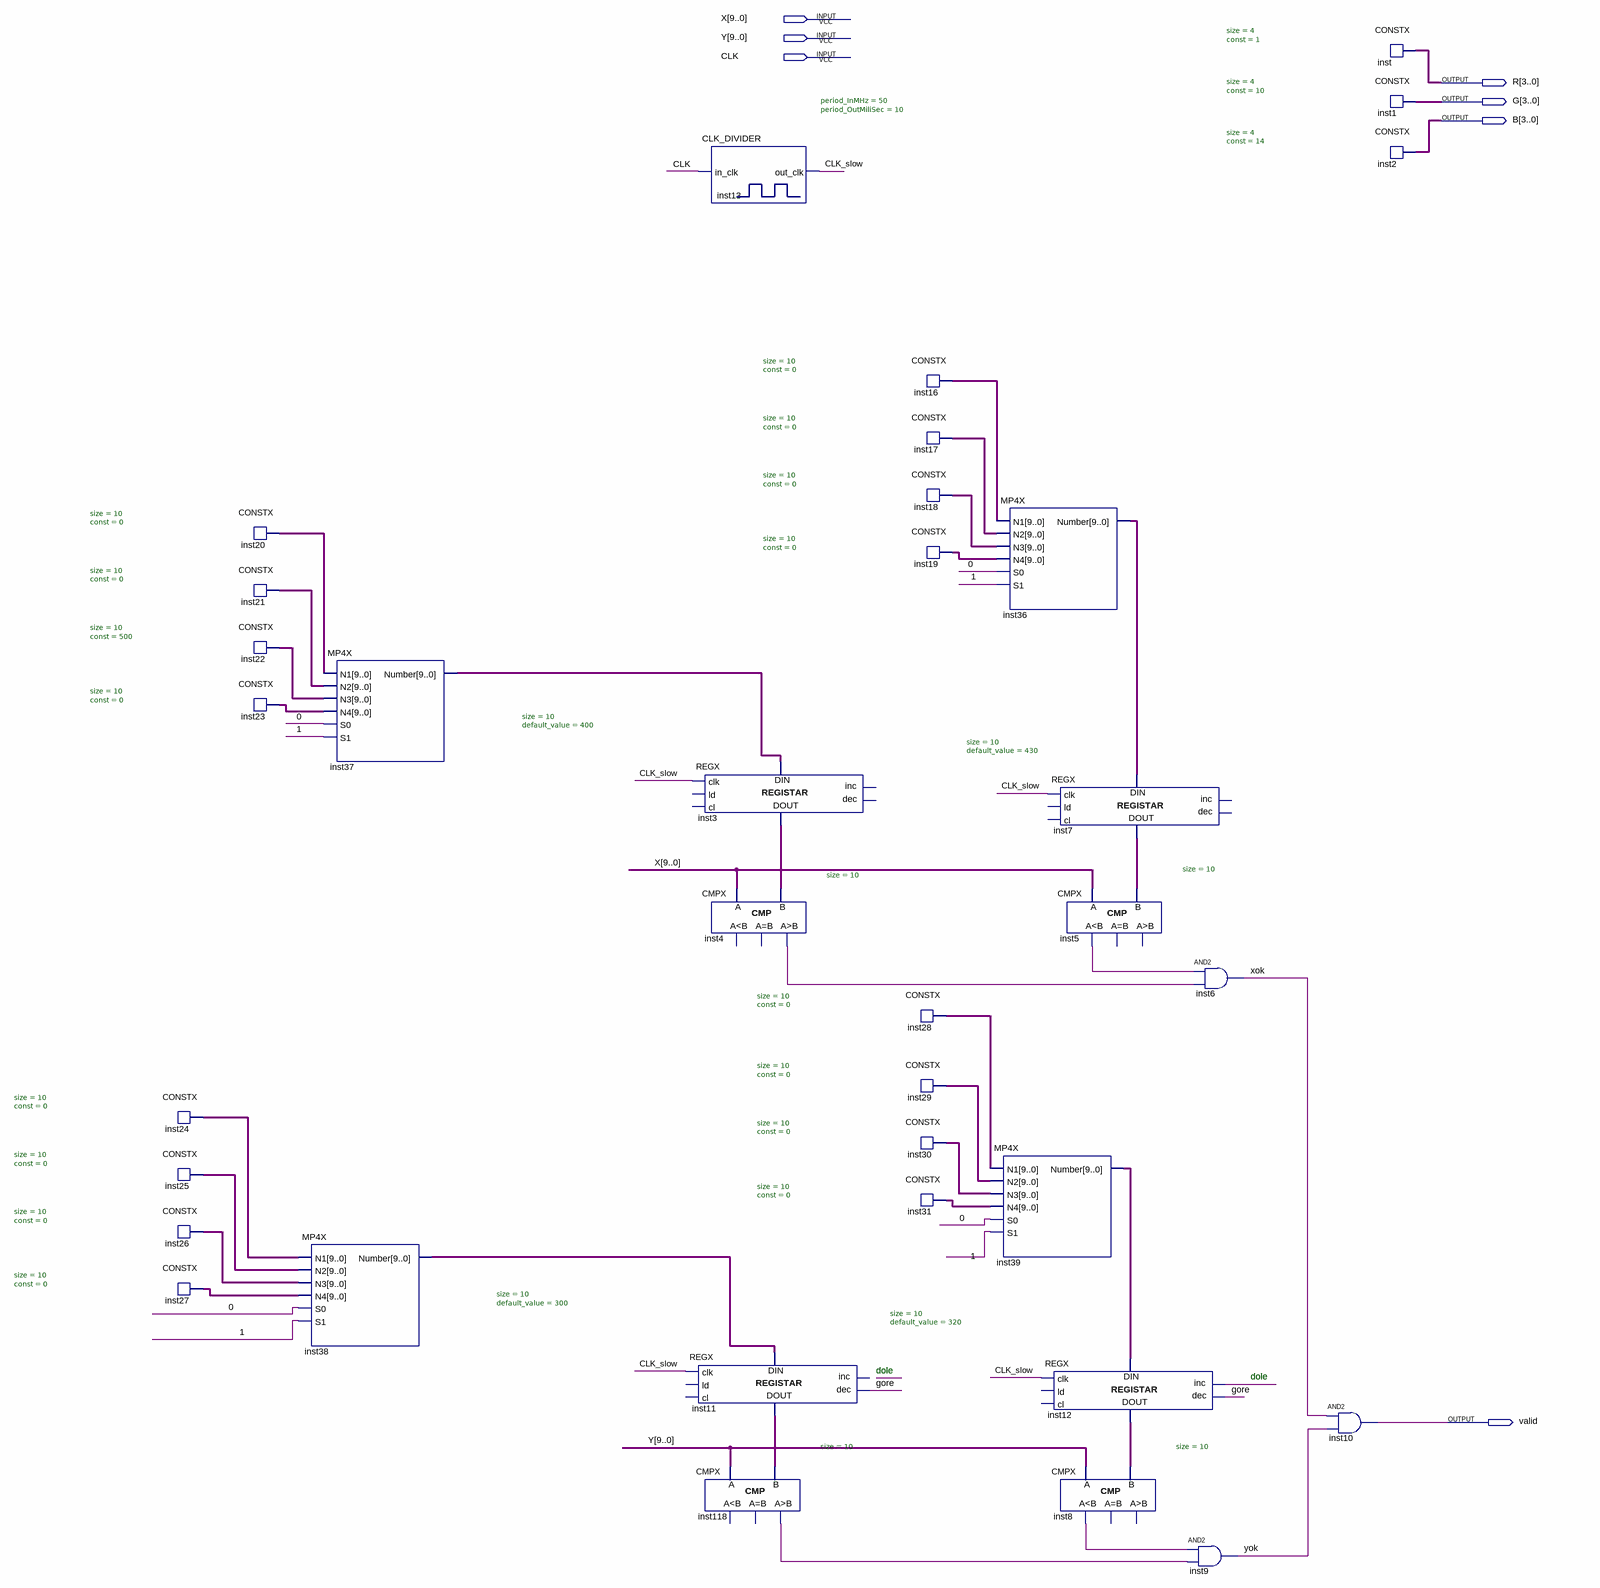
[diagram p0: schematic sheet]
// Quartus schematic generator_blokova.bdf as structural Verilog: 35 symbols, 7 pins
module generator_blokova (
  input  [9:0] X,
  input  [9:0] Y,
  input  CLK,
  output [3:0] R,
  output [3:0] G,
  output [3:0] B,
  output valid
);

  wire \0 , \1 , CLK_slow, dole, gore, inst4_gr, inst5_ls, inst8_ls, inst118_gr, xok, yok;
  wire [9:0] inst3_data_out, inst7_data_out, inst11_data_out, inst12_data_out, inst16_data, inst17_data,
       inst18_data, inst19_data, inst20_data, inst21_data, inst22_data, inst23_data, inst24_data,
       inst25_data, inst26_data, inst27_data, inst28_data, inst29_data, inst30_data, inst31_data,
       inst36_number, inst37_number, inst38_number, inst39_number;

  CONSTX #(.size(10), .\const (0)) inst24 (.data(inst24_data));
  CONSTX #(.size(10), .\const (0)) inst25 (.data(inst25_data));
  CONSTX #(.size(10), .\const (0)) inst26 (.data(inst26_data));
  CONSTX #(.size(10), .\const (0)) inst27 (.data(inst27_data));
  CONSTX #(.size(10), .\const (0)) inst20 (.data(inst20_data));
  CONSTX #(.size(10), .\const (0)) inst21 (.data(inst21_data));
  CONSTX #(.size(10), .\const (500)) inst22 (.data(inst22_data));
  CONSTX #(.size(10), .\const (0)) inst23 (.data(inst23_data));
  MP4X inst37 (
    .N1(inst20_data), .N2(inst21_data), .N3(inst22_data), .N4(inst23_data), .S0(\0 ), .S1(\1 ),
    .Number(inst37_number));
  MP4X inst38 (
    .N1(inst24_data), .N2(inst25_data), .N3(inst26_data), .N4(inst27_data), .S0(\0 ), .S1(\1 ),
    .Number(inst38_number));
  REGX #(.size(10), .default_value(400)) inst3 (
    .clk(CLK_slow), .data_in(inst37_number), .data_out(inst3_data_out));  // open: ld, cl, inc, dec
  REGX #(.size(10), .default_value(300)) inst11 (
    .clk(CLK_slow), .dec(gore), .data_in(inst38_number), .data_out(inst11_data_out));  // open: ld, cl, inc
  CMPX #(.size(10)) inst118 (.A(Y), .B(inst11_data_out), .gr(inst118_gr));  // open: ls, eq
  CLK_DIVIDER #(.period_InMHz(50), .period_OutMiliSec(10)) inst13 (.in_clk(CLK), .out_clk(CLK_slow));
  CMPX #(.size(10)) inst4 (.A(X), .B(inst3_data_out), .gr(inst4_gr));  // open: ls, eq
  CONSTX #(.size(10), .\const (0)) inst16 (.data(inst16_data));
  CONSTX #(.size(10), .\const (0)) inst17 (.data(inst17_data));
  CONSTX #(.size(10), .\const (0)) inst18 (.data(inst18_data));
  CONSTX #(.size(10), .\const (0)) inst19 (.data(inst19_data));
  CONSTX #(.size(10), .\const (0)) inst28 (.data(inst28_data));
  CONSTX #(.size(10), .\const (0)) inst29 (.data(inst29_data));
  CONSTX #(.size(10), .\const (0)) inst30 (.data(inst30_data));
  CONSTX #(.size(10), .\const (0)) inst31 (.data(inst31_data));
  MP4X inst36 (
    .N1(inst16_data), .N2(inst17_data), .N3(inst18_data), .N4(inst19_data), .S0(\0 ), .S1(\1 ),
    .Number(inst36_number));
  MP4X inst39 (
    .N1(inst28_data), .N2(inst29_data), .N3(inst30_data), .N4(inst31_data), .S0(\0 ), .S1(\1 ),
    .Number(inst39_number));
  REGX #(.size(10), .default_value(430)) inst7 (
    .clk(CLK_slow), .data_in(inst36_number), .data_out(inst7_data_out));  // open: ld, cl, inc, dec
  REGX #(.size(10), .default_value(320)) inst12 (
    .clk(CLK_slow), .inc(dole), .dec(gore), .data_in(inst39_number), .data_out(inst12_data_out));  // open: ld, cl
  CMPX #(.size(10)) inst8 (.A(Y), .B(inst12_data_out), .ls(inst8_ls));  // open: eq, gr
  CMPX #(.size(10)) inst5 (.A(X), .B(inst7_data_out), .ls(inst5_ls));  // open: eq, gr
  and inst6 (xok, inst5_ls, inst4_gr);
  and inst9 (yok, inst8_ls, inst118_gr);
  and inst10 (valid, xok, yok);
  CONSTX #(.size(4), .\const (1)) inst (.data(R));
  CONSTX #(.size(4), .\const (10)) inst1 (.data(G));
  CONSTX #(.size(4), .\const (14)) inst2 (.data(B));

  // Notes on the sheet:
  //   dole
  //   dole
endmodule
